# EAGLE schematic Gach_Krzysztf_SMiW_proj_schemat (EAGLE 9.7.0)
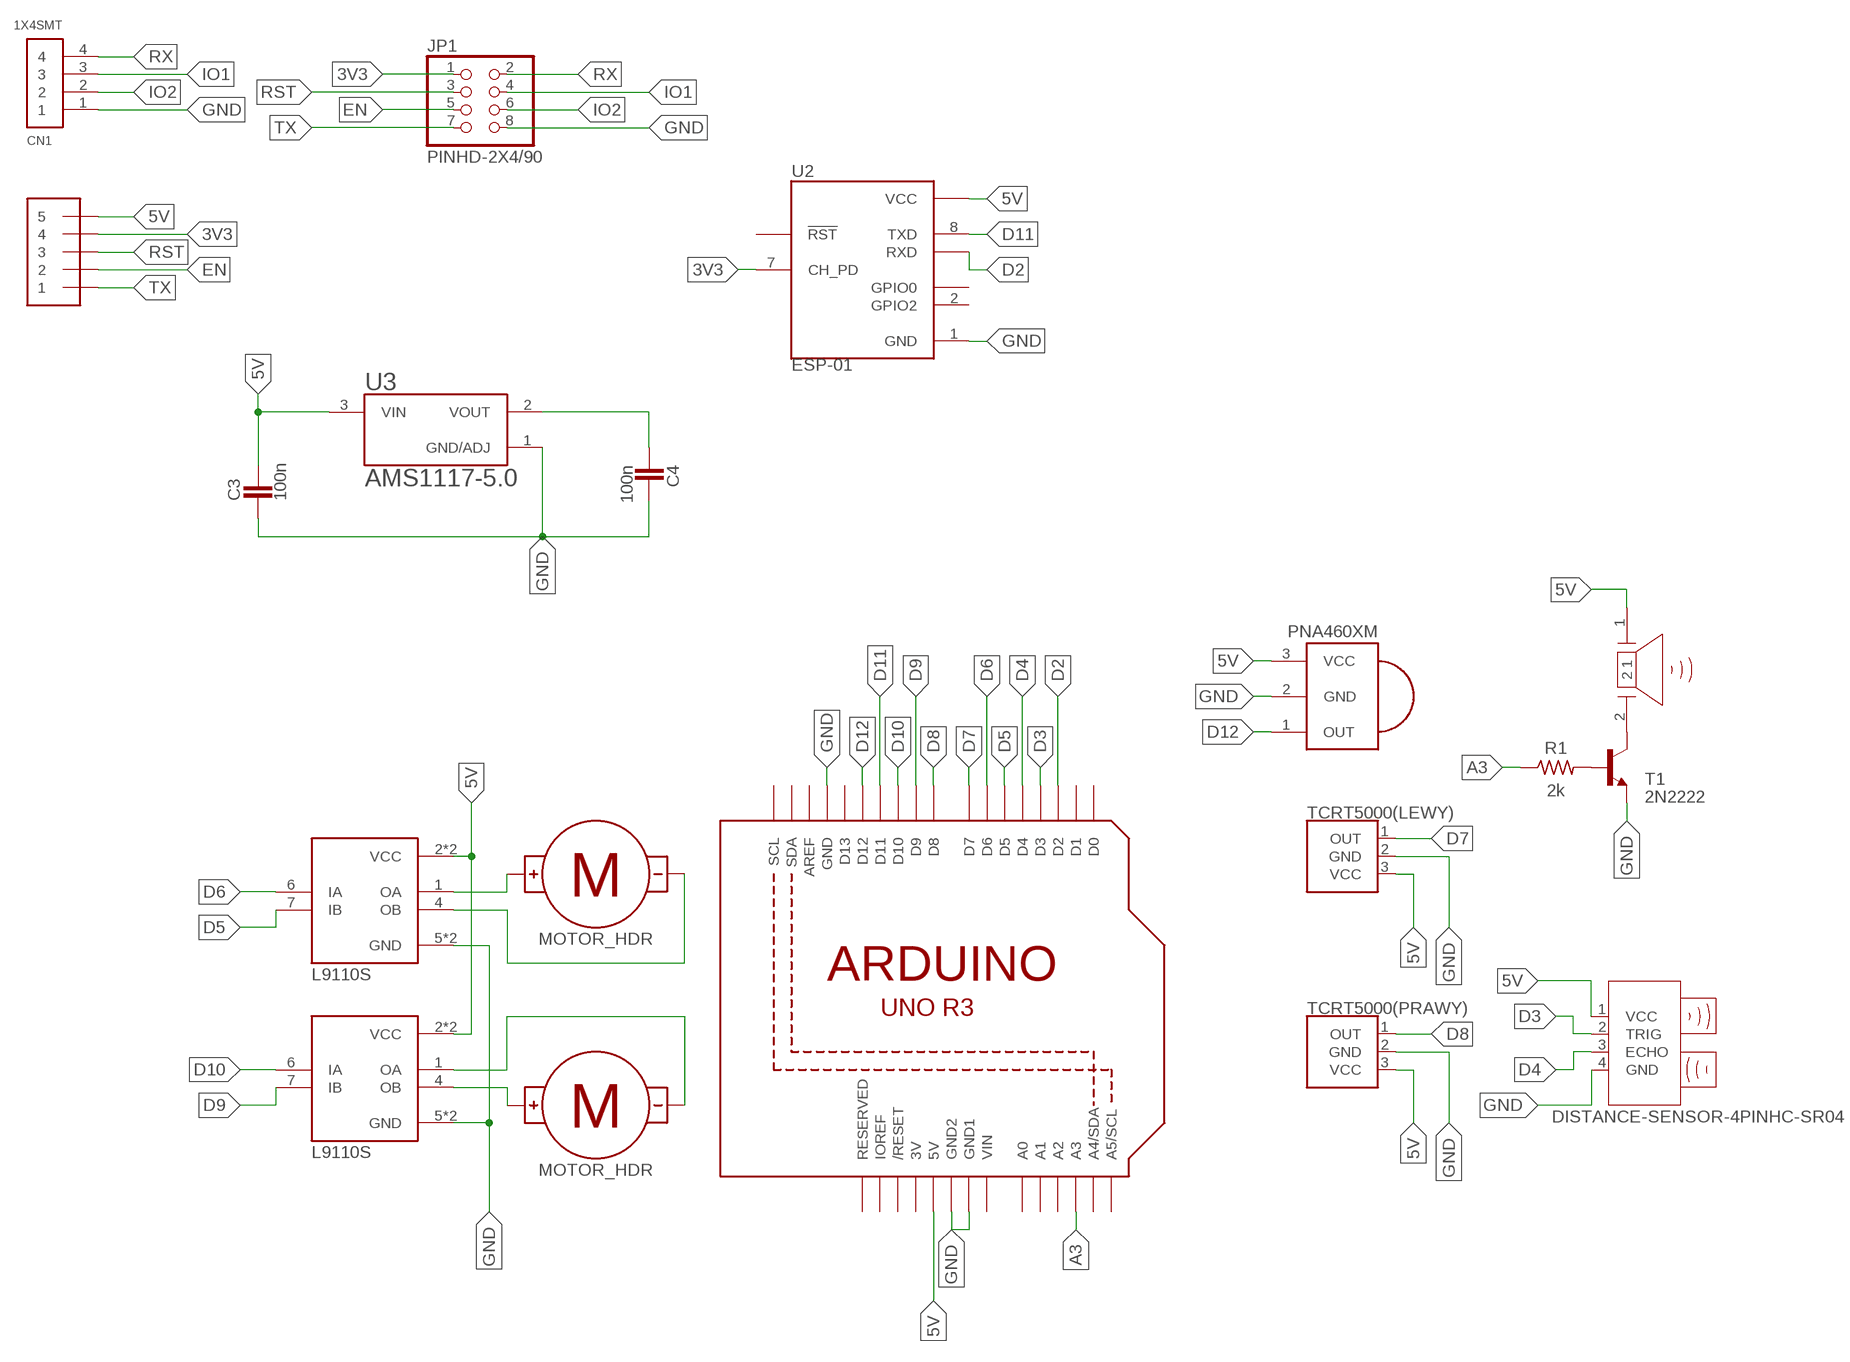
[diagram p0: schematic, sheet 1]

## Parts
5V  PNA460XM  [PNA460XM]
BUZZER  PIEZO  [PIEZO]
C3  100n  CAPACITORCERAMIC-2.54MM  [CAP-THRU-2.54MM]
C4  100n  CAPACITORCERAMIC-2.54MM  [CAP-THRU-2.54MM]
CN1  1X4SMT  [1X4-SMT]
J1  1X5  [1X05-3.5MM]
JP1  PINHD-2X4/90  [2X04/90]
R1  2k  R-US_AXIAL-7.2MM-PITCH  [RESAD724W46L381D178B]
T1  2N2222  [TO92-EBC-OVAL]
TCRT5000(LEWY)  BRM-2A18VERT  [BRM-2508_VERT]
TCRT5000(PRAWY)  BRM-2A18VERT  [BRM-2508_VERT]
U1  ARDUINOR3-BPLACE  [ARDUINOR3-BPLACE]
U2  ESP-01  [MODULE_ESP-01]
U3  AMS1117-5.0  [SOT229P700X180-4N]
U4  L9110S  [SOIC127P599X172-8N]
U5  L9110S  [SOIC127P599X172-8N]
U$1  MOTOR_HDR  [MOTOR]
U$2  MOTOR_HDR  [MOTOR]
U$3  DISTANCE-SENSOR-4PINHC-SR04  [HC-SR04]

## Nets
3V3: J1.4 JP1.1 U2.7(CH_PD)
5V: 5V.3(VCC) BUZZER.1 C3.1 J1.5 TCRT5000(LEWY).3(VCC) TCRT5000(PRAWY).3(VCC) U1.5V U2.5(VCC) U3.3(VIN) U4.2(VCC) U4.3(VCC) U5.2(VCC) U5.3(VCC) U$3.1(VCC)
A3: R1.1 U1.A3
D2: U1.D2 U2.4(RXD)
D3: U1.D3 U$3.2(TRIG)
D4: U1.D4 U$3.3(ECHO)
D5: U1.D5 U4.7(IB)
D6: U1.D6 U4.6(IA)
D7: TCRT5000(LEWY).1(OUT) U1.D7
D8: TCRT5000(PRAWY).1(OUT) U1.D8
D9: U1.D9 U5.7(IB)
D10: U1.D10 U5.6(IA)
D11: U1.D11 U2.8(TXD)
D12: 5V.1(OUT) U1.D12
EN: J1.2 JP1.5
GND: 5V.2(GND) C3.2 C4.1 CN1.1 JP1.8 T1.E TCRT5000(LEWY).2(GND) TCRT5000(PRAWY).2(GND) U1.GND U1.GND1 U1.GND2 U2.1(GND) U3.1(GND/ADJ) U4.5(GND) U4.8(GND) U5.5(GND) U5.8(GND) U$3.4(GND)
IO1: CN1.3 JP1.4
IO2: CN1.2 JP1.6
N$1: U5.4(OB) U$1.+
N$2: U5.1(OA) U$1.-
N$3: U4.1(OA) U$2.+
N$4: U4.4(OB) U$2.-
N$5: R1.2 T1.B
N$6: BUZZER.2 T1.C
N$7: C4.2 U3.2(VOUT)
RST: J1.3 JP1.3
RX: CN1.4 JP1.2
TX: J1.1 JP1.7
Unconnected: U1.A0 U1.A1 U1.A2 U1.A4(A4/SDA) U1.A5(A5/SCL) U1.AREF U1.D0 U1.D1 U1.D13 U1.IOREF U1.RESERVED U1.RESET(/RESET) U1.SCL U1.SDA U2.2(GPIO2) U2.3(GPIO0) U2.6(!RST)

## Power pins joined to a net without a drawn wire
3V: U1.3V
VIN: U1.VIN

## Library data of the parts
5V = adafruit:PNA460XM: IR 38KHz receiver PNA4602 and related receivers http://www.ladyada.net/library/pcb/eaglelibrary.html
BUZZER = Tinkercad:PIEZO: Piezoelectric Sounders / Buzzers Reference Datasheet <https://www.murata.com/products/productdata/8801054621726/SPEC-PKM17EPPH4001-B0.pdf?1517839212000>
C3 C4 = Tinkercad:CAPACITOR: Capacitor - Generic
CN1 = adafruit:1X4: 4-pin connector
J1 = adafruit:1X5
JP1 = Connector:PINHD-2X4: PIN HEADER; CATEGORY: Headers; DESCRIPTION: Header, Right Angle, 2x4 Position; MANUFACTURER: Generic; MPN: Generic; OPERATING_TEMPERATURE: Generic; PART_STATUS: Active; PITCH: 0.100" (2.54mm); ROHS_COMPLIANCE: Generic; SERIES: Generic; SUB-CATEGORY: Headers, Male Pins; TYPE: Board to Board or Cable, Unshrouded, Through Hole, Right Angle
R1 = Resistor:R-US: Resistor Fixed - ANSI; CATEGORY: Resistor; SUB-CATEGORY: Fixed
T1 = adafruit:2N2222: NPN TRANSISTOR Big oval pads
TCRT5000(LEWY) TCRT5000(PRAWY) = SparkFun-Sensors:BRM-2A18: BRM-2A18 IR Receiver The BRM-2A18 is miniaturized infrared receiver for remote control and other applications requiring improved ambient light rejection. Vertical package is a primary component on the ZX Distance and Gesture Sensor. RA package is not currently in-use. Example Datasheet <http://www.sinoskysun.com/upload/20110512/201105120447164615.PDF> SparkFun Products ZX Distance and Gesture Sensor <https://www.sparkfun.com/products/12780> (COM-12780); PROD_ID: COMP-12505
U1 = adafruit:ARDUINOR3: This is a new object for the new Arduino R3 - with extra pins that you may want to use (such as IOref, and duplicated A4/A5
U2 = ESP-01:ESP-01: Check availability <https://pricing.snapeda.com/parts/ESP-01/AI-Thinker/view-part?ref=eda>; AVAILABILITY: Not in stock; CHECK_PRICES: https://www.snapeda.com/parts/ESP-01/AI-Thinker/view-part/?ref=eda; DESCRIPTION: ESP-01M ESP8266 DIP Adapter series Transceiver; 802.11 b/g/n (Wi-Fi, WiFi, WLAN) Evaluation Board; MF: AI-Thinker; MP: ESP-01; PACKAGE: Non-Standard AI-Thinker; PRICE: None; SNAPEDA_LINK: https://www.snapeda.com/parts/ESP-01/AI-Thinker/view-part/?ref=snap
U3 = AMS1117-5.0:AMS1117-5.0: Check availability <https://pricing.snapeda.com/parts/AMS1117-5.0/ams/view-part?ref=eda>; AVAILABILITY: In Stock; CHECK_PRICES: https://www.snapeda.com/parts/AMS1117-5.0/ams/view-part/?ref=eda; DESCRIPTION: 1A LOW DROPOUT VOLTAGE REGULATOR; MF: ams; MP: AMS1117-5.0; PACKAGE: SOT-223 Seeed Technology; PRICE: None; SNAPEDA_LINK: https://www.snapeda.com/parts/AMS1117-5.0/ams/view-part/?ref=snap
U4 U5 = L9110S:L9110S: Check availability <https://pricing.snapeda.com/parts/L9110S/LG%20Semicon/view-part?ref=eda>; AVAILABILITY: Not in stock; CHECK_PRICES: https://www.snapeda.com/parts/L9110S/Onsemi/view-part/?ref=eda; DESCRIPTION: IC REG BUCK BOOST 20WLCSP; MF: LG Semicon; MP: L9110S; PACKAGE: None; PRICE: None; SNAPEDA_LINK: https://www.snapeda.com/parts/L9110S/Onsemi/view-part/?ref=snap
U$1 U$2 = Tinkercad:MOTOR
U$3 = Tinkercad:DISTANCE-SENSOR-4PIN